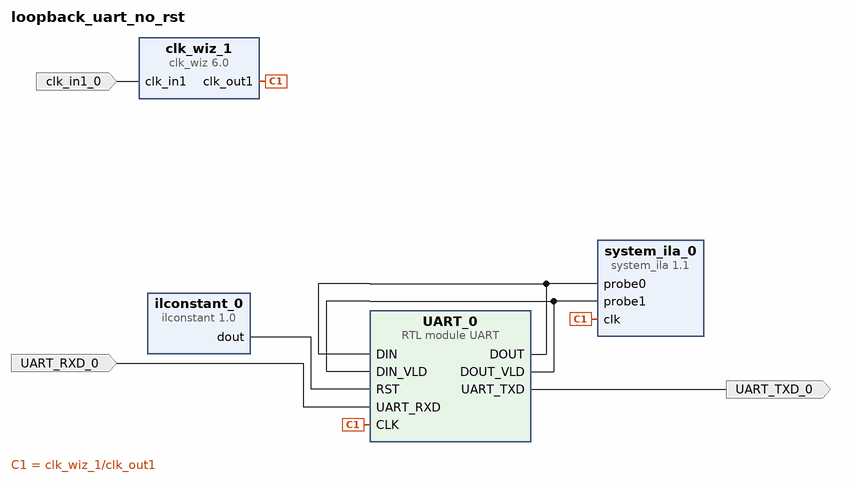
[diagram p0: block diagram of the top level]
# Vivado block design loopback_uart_no_rst, xc7s25csga324-1, Vivado 2025.1
create_bd_design loopback_uart_no_rst

create_bd_port -dir I UART_RXD_0
create_bd_port -dir O UART_TXD_0
create_bd_port -dir I -type clk clk_in1_0

create_bd_cell -type ip -vlnv xilinx.com:ip:clk_wiz:6.0 clk_wiz_1
set_property -dict [list \
  CONFIG.CLKOUT1_REQUESTED_OUT_FREQ 100.0 \
  CONFIG.RESET_BOARD_INTERFACE Custom \
  CONFIG.USE_RESET false \
] [get_bd_cells clk_wiz_1]
create_bd_cell -type module -reference UART UART_0
create_bd_cell -type ip -vlnv xilinx.com:ip:system_ila:1.1 system_ila_0
set_property -dict [list \
  CONFIG.C_DATA_DEPTH 65536 \
  CONFIG.C_MON_TYPE NATIVE \
  CONFIG.C_NUM_OF_PROBES 2 \
  CONFIG.C_PROBE0_TYPE 0 \
  CONFIG.C_PROBE1_TYPE 0 \
] [get_bd_cells system_ila_0]
create_bd_cell -type inline_hdl -vlnv xilinx.com:inline_hdl:ilconstant:1.0 ilconstant_0
set_property -dict {CONFIG.CONST_VAL 0} [get_bd_cells ilconstant_0]

# ---- connections ----

connect_bd_net -net UART_0_DOUT [get_bd_pins UART_0/DOUT] [get_bd_pins system_ila_0/probe0] [get_bd_pins UART_0/DIN]
connect_bd_net -net UART_0_DOUT_VLD [get_bd_pins UART_0/DOUT_VLD] [get_bd_pins system_ila_0/probe1] [get_bd_pins UART_0/DIN_VLD]
connect_bd_net [get_bd_pins UART_0/UART_TXD] [get_bd_ports UART_TXD_0]
connect_bd_net -net UART_RXD_0_1 [get_bd_ports UART_RXD_0] [get_bd_pins UART_0/UART_RXD]
connect_bd_net -net clk_in1_0_1 [get_bd_ports clk_in1_0] [get_bd_pins clk_wiz_1/clk_in1]
connect_bd_net [get_bd_pins clk_wiz_1/clk_out1] [get_bd_pins system_ila_0/clk] [get_bd_pins UART_0/CLK]
connect_bd_net [get_bd_pins ilconstant_0/dout] [get_bd_pins UART_0/RST]
set_property HDL_ATTRIBUTE.DEBUG true [get_bd_nets UART_0_DOUT]
set_property HDL_ATTRIBUTE.MARK_DEBUG true [get_bd_nets UART_0_DOUT]
set_property HDL_ATTRIBUTE.DEBUG true [get_bd_nets UART_0_DOUT_VLD]
set_property HDL_ATTRIBUTE.MARK_DEBUG true [get_bd_nets UART_0_DOUT_VLD]

validate_bd_design
save_bd_design
